# Altium schematic sheet UPCNSL_ABS_EPS_POL_v.2.1.SchDoc
size A2
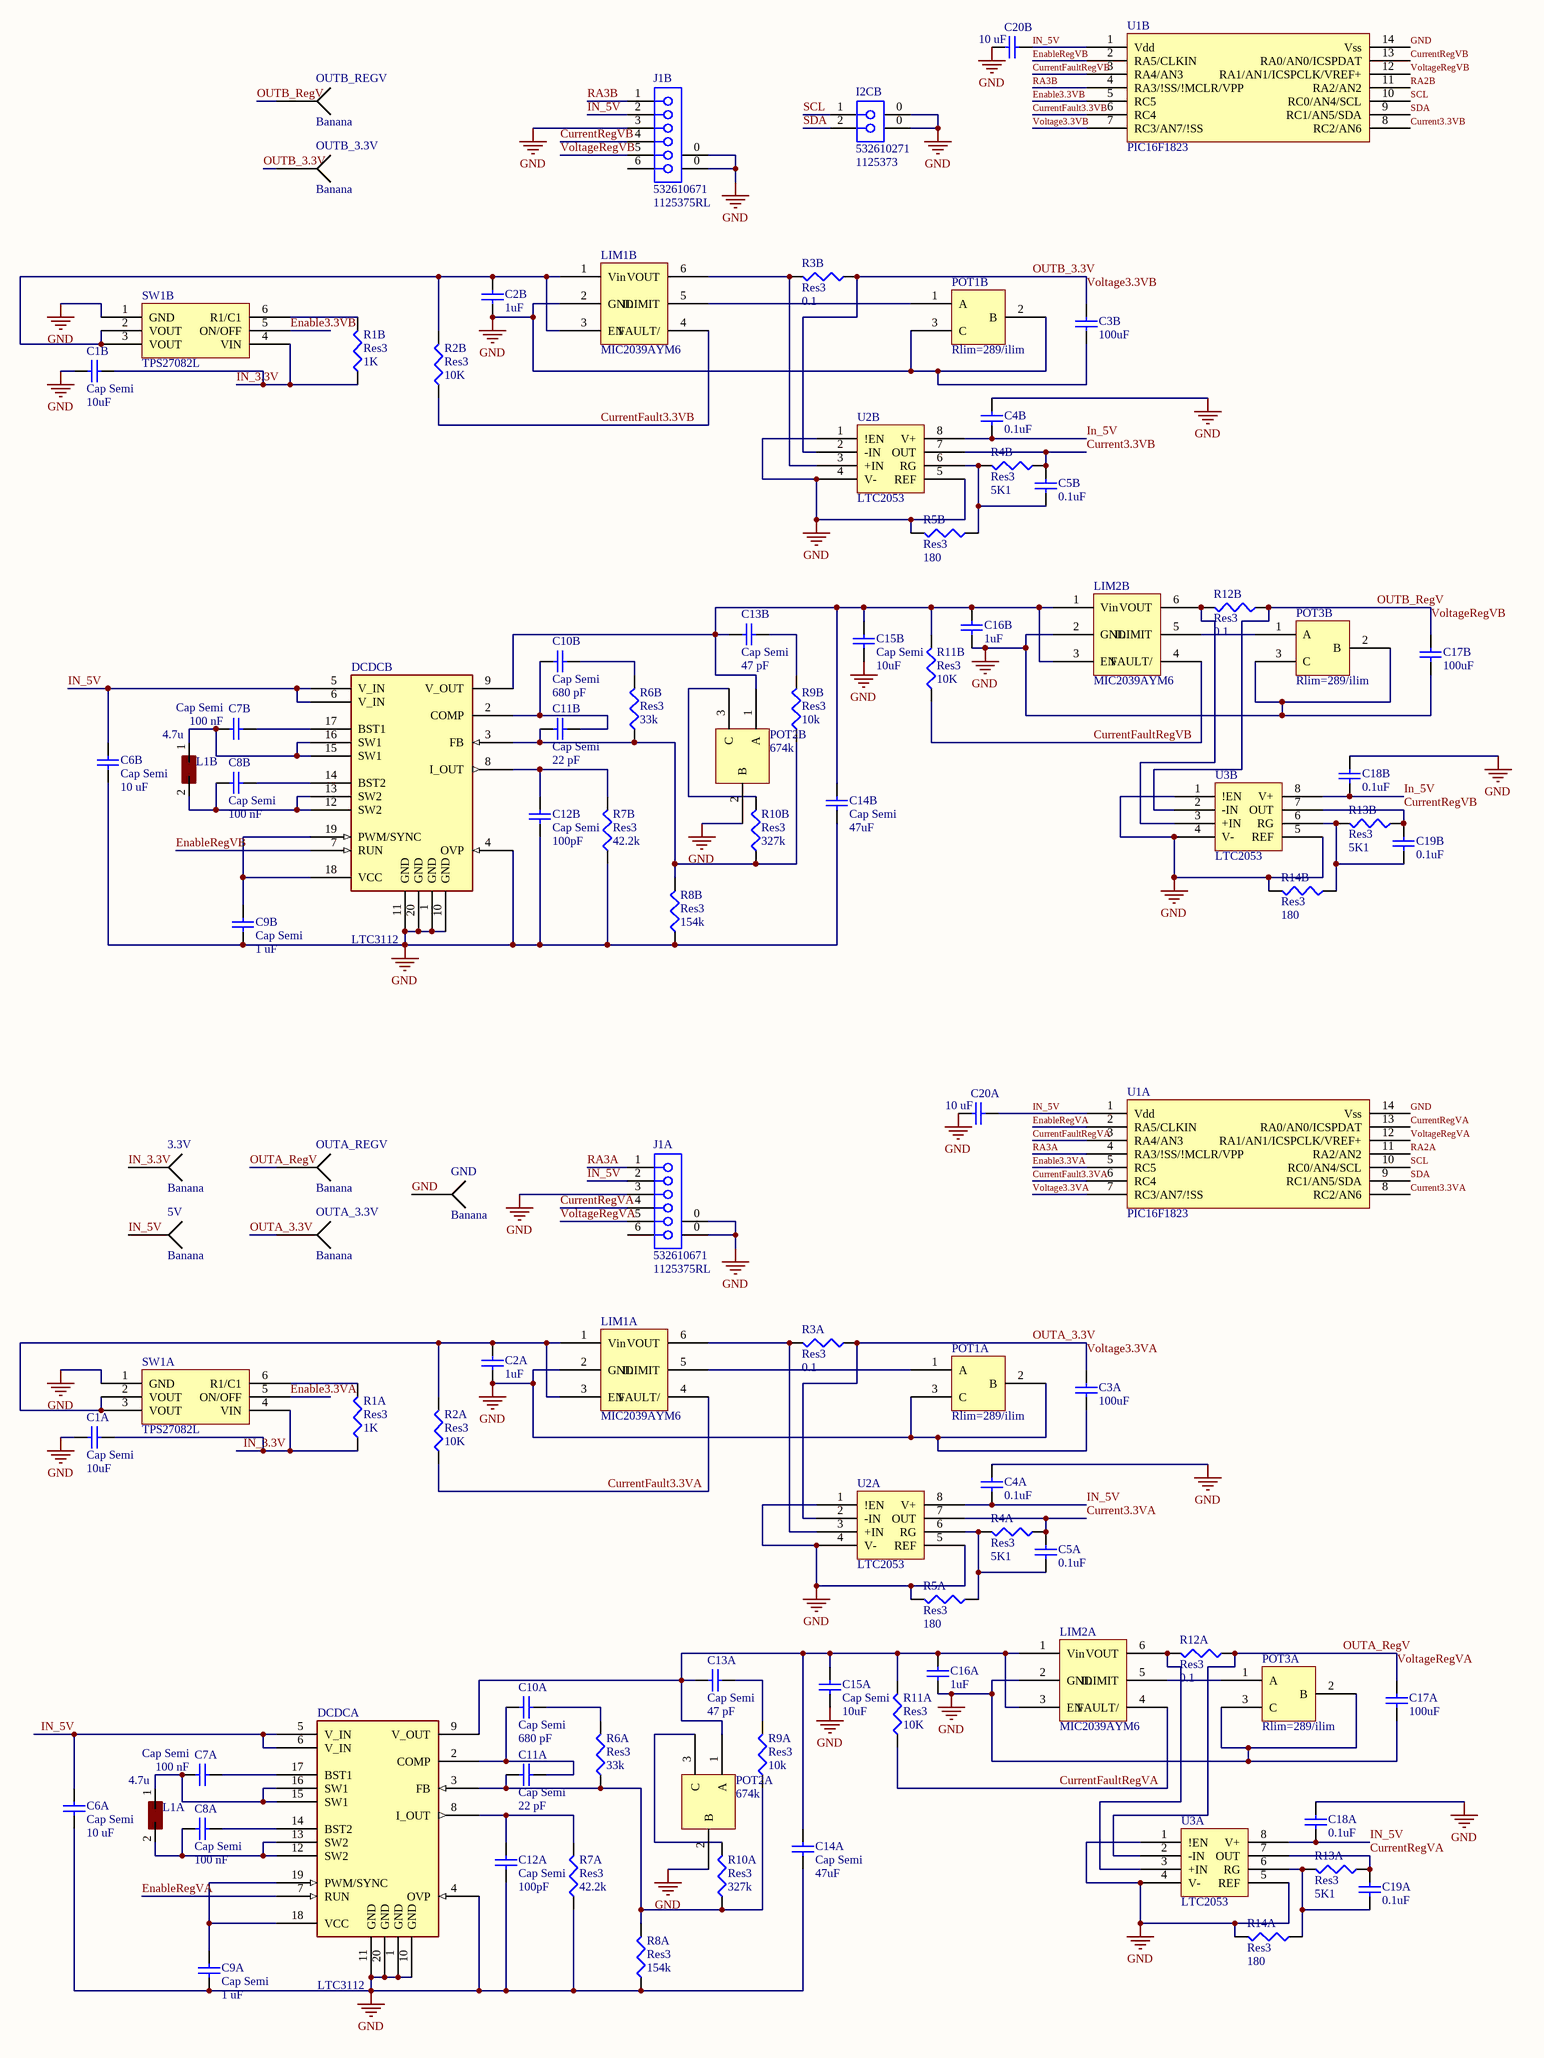
[diagram p0: UPCNSL_ABS_EPS_POL_v.2.1.SchDoc]

## Parts
3.3V  Banana  [Banana]
5V  Banana  [Banana]
C1A  Cap Semi  value 10uF  [1608[0603]]
C1B  Cap Semi  value 10uF  [1608[0603]]
C2A  value 1uF  [CAP0603]  (hidden comment: CAP0603)
C2B  value 1uF  [CAP0603]  (hidden comment: CAP0603)
C3A  value 100uF  [CAP0603]  (hidden comment: CAP0603)
C3B  value 100uF  [CAP0603]  (hidden comment: CAP0603)
C4A  value 0.1uF  [CAP0603]  (hidden comment: CAP0603)
C4B  value 0.1uF  [CAP0603]  (hidden comment: CAP0603)
C5A  value 0.1uF  [CAP0603]  (hidden comment: CAP0603)
C5B  value 0.1uF  [CAP0603]  (hidden comment: CAP0603)
C6A  Cap Semi  value 10 uF  [CAP0603]
C6B  Cap Semi  value 10 uF  [CAP0603]
C7A  Cap Semi  value 100 nF  [CAP0603]
C7B  Cap Semi  value 100 nF  [CAP0603]
C8A  Cap Semi  value 100 nF  [CAP0603]
C8B  Cap Semi  value 100 nF  [CAP0603]
C9A  Cap Semi  value 1 uF  [CAP0603]
C9B  Cap Semi  value 1 uF  [CAP0603]
C10A  Cap Semi  value 680 pF  [CAP0603]
C10B  Cap Semi  value 680 pF  [CAP0603]
C11A  Cap Semi  value 22 pF  [CAP0603]
C11B  Cap Semi  value 22 pF  [CAP0603]
C12A  Cap Semi  value 100pF  [CAP0603]
C12B  Cap Semi  value 100pF  [CAP0603]
C13A  Cap Semi  value 47 pF  [CAP0603]
C13B  Cap Semi  value 47 pF  [CAP0603]
C14A  Cap Semi  value 47uF  [C1206]
C14B  Cap Semi  value 47uF  [C1206]
C15A  Cap Semi  value 10uF  [1608[0603]]
C15B  Cap Semi  value 10uF  [1608[0603]]
C16A  value 1uF  [CAP0603]  (hidden comment: CAP0603)
C16B  value 1uF  [CAP0603]  (hidden comment: CAP0603)
C17A  value 100uF  [CAP0603]  (hidden comment: CAP0603)
C17B  value 100uF  [CAP0603]  (hidden comment: CAP0603)
C18A  value 0.1uF  [CAP0603]  (hidden comment: CAP0603)
C18B  value 0.1uF  [CAP0603]  (hidden comment: CAP0603)
C19A  value 0.1uF  [CAP0603]  (hidden comment: CAP0603)
C19B  value 0.1uF  [CAP0603]  (hidden comment: CAP0603)
C20A  value 10 uF  [CAP0603]  (hidden comment: Cap Semi)
C20B  value 10 uF  [CAP0603]  (hidden comment: Cap Semi)
DCDCA  LTC3112  [LTC3112TSOP]
DCDCB  LTC3112  [LTC3112TSOP]
GND  Banana  [Banana]
I2CB  532610271  Supplier Part Number 1: 1125373  [532610271]
J1A  532610671  Supplier Part Number 1: 1125375RL  [532610671]
J1B  532610671  Supplier Part Number 1: 1125375RL  [532610671]
L1A  INDUCTOR  [INDUCTOR - 1008[2520]]  (value not drawn)
L1B  INDUCTOR  [INDUCTOR - 1008[2520]]  (value not drawn)
LIM1A  MIC2039AYM6  [SOT23-6_M]
LIM1B  MIC2039AYM6  [SOT23-6_M]
LIM2A  MIC2039AYM6  [SOT23-6_M]
LIM2B  MIC2039AYM6  [SOT23-6_M]
OUTA_3.3V  Banana  [Banana]
OUTA_REGV  Banana  [Banana]
OUTB_3.3V  Banana  [Banana]
OUTB_REGV  Banana  [Banana]
POT1A  Rlim=289/ilim  [Potenciometre no recte]
POT1B  Rlim=289/ilim  [Potenciometre no recte]
POT2A  674k  [Potenciometre no recte]
POT2B  674k  [Potenciometre no recte]
POT3A  Rlim=289/ilim  [Potenciometre no recte]
POT3B  Rlim=289/ilim  [Potenciometre no recte]
R1A  Res3  value 1K  [J1-0603]
R1B  Res3  value 1K  [J1-0603]
R2A  Res3  value 10K  [J1-0603]
R2B  Res3  value 10K  [J1-0603]
R3A  Res3  value 0.1  [J1-0603]
R3B  Res3  value 0.1  [J1-0603]
R4A  Res3  value 5K1  [J1-0603]
R4B  Res3  value 5K1  [J1-0603]
R5A  Res3  value 180  [J1-0603]
R5B  Res3  value 180  [J1-0603]
R6A  Res3  value 33k  [J1-0603]
R6B  Res3  value 33k  [J1-0603]
R7A  Res3  value 42.2k  [J1-0603]
R7B  Res3  value 42.2k  [J1-0603]
R8A  Res3  value 154k  [J1-0603]
R8B  Res3  value 154k  [J1-0603]
R9A  Res3  value 10k  [J1-0603]
R9B  Res3  value 10k  [J1-0603]
R10A  Res3  value 327k  [J1-0603]
R10B  Res3  value 327k  [J1-0603]
R11A  Res3  value 10K  [J1-0603]
R11B  Res3  value 10K  [J1-0603]
R12A  Res3  value 0.1  [J1-0603]
R12B  Res3  value 0.1  [J1-0603]
R13A  Res3  value 5K1  [J1-0603]
R13B  Res3  value 5K1  [J1-0603]
R14A  Res3  value 180  [J1-0603]
R14B  Res3  value 180  [J1-0603]
SW1A  TPS27082L  [TPS27082L]
SW1B  TPS27082L  [TPS27082L]
U1A  PIC16F1823  [PIC16F1823]
U1B  PIC16F1823  [PIC16F1823]
U2A  LTC2053  [LTC2053 IPC]
U2B  LTC2053  [LTC2053 IPC]
U3A  LTC2053  [LTC2053 IPC]
U3B  LTC2053  [LTC2053 IPC]

## Nets
GND: C1A.1 C1B.1 C2A.2 C2B.2 C3A.2 C3B.2 C4A.1 C4B.1 C6A.1 C6B.1 C9A.1 C9B.1 C12A.1 C12B.1 C14A.2 C14B.2 C15A.1 C15B.1 C16A.2 C16B.2 C17A.2 C17B.2 C18A.1 C18B.1 C20A.2 C20B.2 DCDCA.1(GND) DCDCA.4(OVP) DCDCA.10(GND) DCDCA.11(GND) DCDCA.20(GND) DCDCB.1(GND) DCDCB.4(OVP) DCDCB.10(GND) DCDCB.11(GND) DCDCB.20(GND) GND.1 I2CB.0(MH1) J1A.0(MH1) J1A.3 J1B.0(MH1) J1B.3 LIM1A.2(GND) LIM1B.2(GND) LIM2A.2(GND) LIM2B.2(GND) POT1A.2(B) POT1A.3(C) POT1B.2(B) POT1B.3(C) POT2A.2(B) POT2B.2(B) POT3A.2(B) POT3A.3(C) POT3B.2(B) POT3B.3(C) R5A.2 R5B.2 R7A.1 R7B.1 R8A.1 R8B.1 R14A.2 R14B.2 SW1A.1(GND) SW1B.1(GND) U1A.14(Vss) U1B.14(Vss) U2A.1(!EN) U2A.4(V-) U2A.5(REF) U2B.1(!EN) U2B.4(V-) U2B.5(REF) U3A.1(!EN) U3A.4(V-) U3A.5(REF) U3B.1(!EN) U3B.4(V-) U3B.5(REF)
Current3.3VA: C5A.1 R4A.1 U1A.8(RC2/AN6) U2A.7(OUT)
Current3.3VB: C5B.1 R4B.1 U1B.8(RC2/AN6) U2B.7(OUT)
CurrentFault3.3VA: LIM1A.4(FAULT/) R2A.1 U1A.6(RC4)
CurrentFault3.3VB: LIM1B.4(FAULT/) R2B.1 U1B.6(RC4)
CurrentFaultRegVA: LIM2A.4(FAULT/) R11A.1 U1A.3(RA4/AN3)
CurrentFaultRegVB: LIM2B.4(FAULT/) R11B.1 U1B.3(RA4/AN3)
CurrentRegVA: C19A.1 J1A.4 R13A.1 U1A.13(RA0/AN0/ICSPDAT) U3A.7(OUT)
CurrentRegVB: C19B.1 J1B.4 R13B.1 U1B.13(RA0/AN0/ICSPDAT) U3B.7(OUT)
Enable3.3VA: SW1A.5(ON/OFF) U1A.5(RC5)
Enable3.3VB: SW1B.5(ON/OFF) U1B.5(RC5)
EnableRegVA: DCDCA.7(RUN) U1A.2(RA5/CLKIN)
EnableRegVB: DCDCB.7(RUN) U1B.2(RA5/CLKIN)
IN_3.3V: 3.3V.1 C1A.2 C1B.2 R1A.1 R1B.1 SW1A.4(VIN) SW1B.4(VIN)
IN_5V: 5V.1 C4A.2 C4B.2 C6A.2 C6B.2 C18A.2 C18B.2 C20A.1 C20B.1 DCDCA.5(V_IN) DCDCA.6(V_IN) DCDCB.5(V_IN) DCDCB.6(V_IN) J1A.2 J1B.2 U1A.1(Vdd) U1B.1(Vdd) U2A.8(V+) U2B.8(V+) U3A.8(V+) U3B.8(V+)
OUTA_3.3V: C3A.1 OUTA_3.3V.1 R3A.1 U1A.7(RC3/AN7/!SS) U2A.2(-IN)  [also labelled Voltage3.3VA]
OUTA_RegV: C17A.1 J1A.5 OUTA_REGV.1 R12A.1 U1A.12(RA1/AN1/ICSPCLK/VREF+) U3A.2(-IN)  [also labelled VoltageRegVA]
OUTB_3.3V: C3B.1 OUTB_3.3V.1 R3B.1 U1B.7(RC3/AN7/!SS) U2B.2(-IN)  [also labelled Voltage3.3VB]
OUTB_RegV: C17B.1 J1B.5 OUTB_REGV.1 R12B.1 U1B.12(RA1/AN1/ICSPCLK/VREF+) U3B.2(-IN)  [also labelled VoltageRegVB]
RA2A: U1A.11(RA2/AN2)
RA2B: U1B.11(RA2/AN2)
RA3A: J1A.1 U1A.4(RA3/!SS/!MCLR/VPP)
RA3B: J1B.1 U1B.4(RA3/!SS/!MCLR/VPP)
SCL: I2CB.1 U1A.10(RC0/AN4/SCL) U1B.10(RC0/AN4/SCL)
SDA: I2CB.2 U1A.9(RC1/AN5/SDA) U1B.9(RC1/AN5/SDA)
NetC2A_1: C2A.1 LIM1A.1(Vin) LIM1A.3(EN) R2A.2 SW1A.2(VOUT) SW1A.3(VOUT)
NetC2B_1: C2B.1 LIM1B.1(Vin) LIM1B.3(EN) R2B.2 SW1B.2(VOUT) SW1B.3(VOUT)
NetC5A_2: C5A.2 R4A.2 R5A.1 U2A.6(RG)
NetC5B_2: C5B.2 R4B.2 R5B.1 U2B.6(RG)
NetC7A_1: C7A.1 DCDCA.15(SW1) DCDCA.16(SW1) L1A.1
NetC7A_2: C7A.2 DCDCA.17(BST1)
NetC7B_1: C7B.1 DCDCB.15(SW1) DCDCB.16(SW1) L1B.1
NetC7B_2: C7B.2 DCDCB.17(BST1)
NetC8A_1: C8A.1 DCDCA.12(SW2) DCDCA.13(SW2) L1A.2
NetC8A_2: C8A.2 DCDCA.14(BST2)
NetC8B_1: C8B.1 DCDCB.12(SW2) DCDCB.13(SW2) L1B.2
NetC8B_2: C8B.2 DCDCB.14(BST2)
NetC9A_2: C9A.2 DCDCA.18(VCC) DCDCA.19(PWM/SYNC)
NetC9B_2: C9B.2 DCDCB.18(VCC) DCDCB.19(PWM/SYNC)
NetC10A_1: C10A.1 C11A.2 DCDCA.2(COMP)
NetC10A_2: C10A.2 R6A.2
NetC10B_1: C10B.1 C11B.2 DCDCB.2(COMP)
NetC10B_2: C10B.2 R6B.2
NetC11A_1: C11A.1 DCDCA.3(FB) R6A.1 R8A.2 R9A.1 R10A.1
NetC11B_1: C11B.1 DCDCB.3(FB) R6B.1 R8B.2 R9B.1 R10B.1
NetC12A_2: C12A.2 DCDCA.8(I_OUT) R7A.2
NetC12B_2: C12B.2 DCDCB.8(I_OUT) R7B.2
NetC13A_1: C13A.1 C14A.1 C15A.2 C16A.1 DCDCA.9(V_OUT) LIM2A.1(Vin) LIM2A.3(EN) POT2A.1(A) R11A.2
NetC13A_2: C13A.2 R9A.2
NetC13B_1: C13B.1 C14B.1 C15B.2 C16B.1 DCDCB.9(V_OUT) LIM2B.1(Vin) LIM2B.3(EN) POT2B.1(A) R11B.2
NetC13B_2: C13B.2 R9B.2
NetC19A_2: C19A.2 R13A.2 R14A.1 U3A.6(RG)
NetC19B_2: C19B.2 R13B.2 R14B.1 U3B.6(RG)
NetLIM1A_5: LIM1A.5(ILIMIT) POT1A.1(A)
NetLIM1A_6: LIM1A.6(VOUT) R3A.2 U2A.3(+IN)
NetLIM1B_5: LIM1B.5(ILIMIT) POT1B.1(A)
NetLIM1B_6: LIM1B.6(VOUT) R3B.2 U2B.3(+IN)
NetLIM2A_5: LIM2A.5(ILIMIT) POT3A.1(A)
NetLIM2A_6: LIM2A.6(VOUT) R12A.2 U3A.3(+IN)
NetLIM2B_5: LIM2B.5(ILIMIT) POT3B.1(A)
NetLIM2B_6: LIM2B.6(VOUT) R12B.2 U3B.3(+IN)
NetPOT2A_3: POT2A.3(C) R10A.2
NetPOT2B_3: POT2B.3(C) R10B.2
NetR1A_2: R1A.2 SW1A.6(R1/C1)
NetR1B_2: R1B.2 SW1B.6(R1/C1)

Not connected (* = marked no-connect by the designer): J1A 6; J1B 6

## Notes on the sheet
- (in symbol INDUCTOR) 4.7u

## Library data of the parts
C1A C1B C6A C6B C7A C7B C8A C8B C9A C9B C10A C10B C11A C11B C12A C12B C13A C13B C14A C14B C15A C15B C20A C20B = Cap Semi: Capacitor (Semiconductor SIM Model); Published: 8-Jun-2000; LatestRevisionDate: 29-May-2009; LatestRevisionNote: IPC-7351 Footprint Added.; PackageReference: C1206; Publisher: Altium Limited; PackageDescription: Chip Capacitor
C2A C2B C3A C3B C4A C4B C5A C5B C16A C16B C17A C17B C18A C18B C19A C19B = CAP0603: Capacitor
DCDCA DCDCB = LTC3112Modi
I2CB = MOLEX_532610271: 1.25mm Pitch PicoBlade™ Header, Surface Mount, Right Angle, Lead-Free, 2 Circuits; Supplier 1: Farnell
J1A J1B = MOLEX_532610671: 1.25mm Pitch PicoBlade™ Header, Surface Mount, Right Angle, Lead-Free, 6 Circuits; Supplier 1: Farnell
LIM1A LIM1B LIM2A LIM2B = MIC2039
POT1A POT1B POT2A POT2B POT3A POT3B = Potenciometre
R1A R1B R2A R2B R3A R3B R4A R4B R5A R5B R6A R6B R7A R7B R8A R8B R9A R9B R10A R10B R11A R11B R12A R12B R13A R13B R14A R14B = Res3: Resistor; Published: 8-Jun-2000; LatestRevisionDate: 29-May-2009; LatestRevisionNote: IPC-7351 Footprint Added.; PackageReference: J1-0603; Publisher: Altium Limited; PackageDescription: Chip Resistor